# Altium schematic sheet SKC_DataComm.SchDoc: SKC Data Comm
size A4; Author: eldar6776@hotmail.com; DrawnBy: Eldar Dedić; Organization: PROVEN d.o.o.; Address1: Adema Buće 102; Address2: 71000 Sarajevo; Address3: Federacija BiH; Address4: Bosna i Hercegovina; DocumentNumber: DE211213; Revision: 001; SheetNumber: 15; SheetTotal: 15; ProjectName: MIKSER SIROVINE
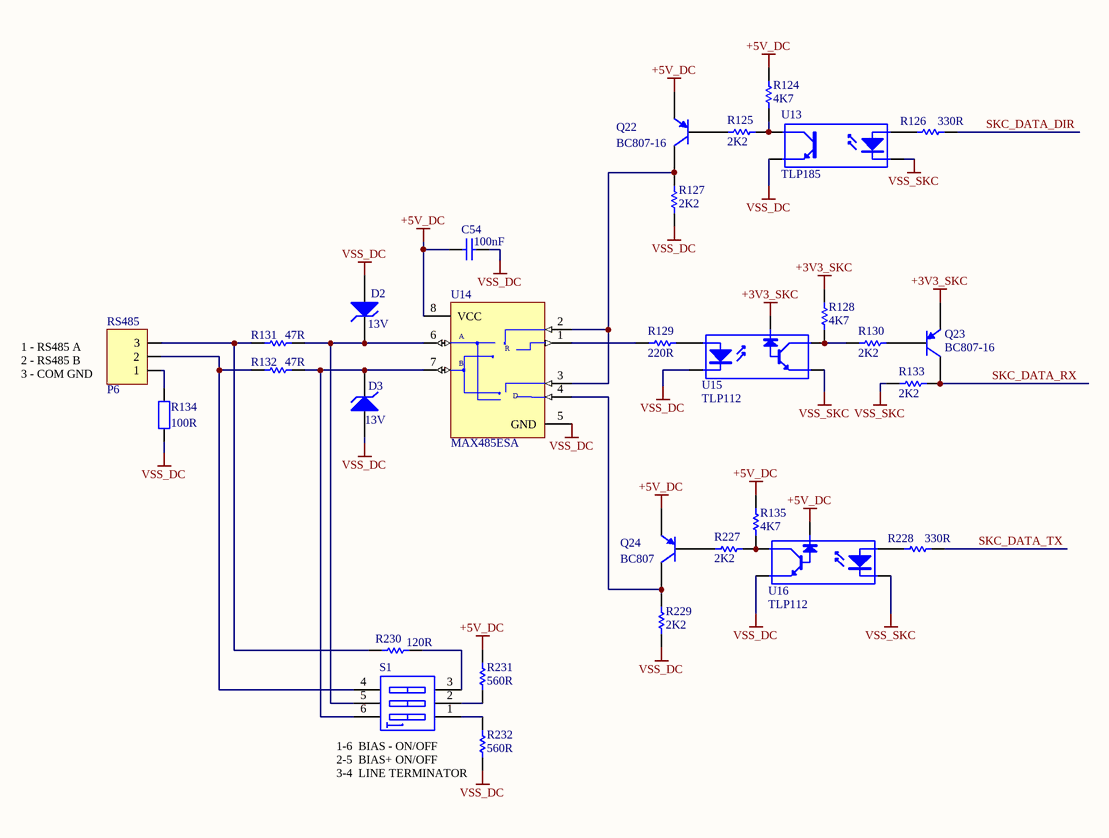
[diagram p0: SKC_DataComm.SchDoc]

## Parts
C54  100nF  [1206]
D2  13V  [DO-35A]
D3  13V  [DO-35A]
P6  RS485  [TERMINAL BLOK 3]
Q22  BC807-16  [SOT23_N]
Q23  BC807-16  [SOT23_N]
Q24  BC807  [SOT23_N]
R124  4K7  [ERA-0805]
R125  2K2  [ERA-0805]
R126  330R  [ERA-0805]
R127  2K2  [8-1206]
R128  4K7  [ERA-0805]
R129  220R  [ERA-0805]
R130  2K2  [ERA-0805]
R131  47R  [ERA-0805]
R132  47R  [ERA-0805]
R133  2K2  [8-1206]
R134  100R  [AXIAL-0.4]
R135  4K7  [ERA-0805]
R227  2K2  [8-1206]
R228  330R  [ERA-0805]
R229  2K2  [8-1206]
R230  120R  [ERA-0805]
R231  560R  [ERA-0805]
R232  560R  [ERA-0805]
S1  (no value)  [DIP-6]
U13  TLP185  [SOP4]
U14  MAX485ESA  [NSO8_N]
U15  TLP112  [SOP5]
U16  TLP112  [SOP5]

## Nets
+3V3_SKC: Q23.2(E) R128.1 U15.6(K)
+5V_DC: C54.2 Q22.2(E) Q24.2(E) R124.1 R135.1 R231.2 U14.8(VCC) U16.6(K)
VSS_DC: C54.1 D2.1(A) D3.1(A) R127.1 R134.1 R229.1 R232.1 U13.4(E) U14.5(GND) U15.3(K) U16.4(E)
VSS_SKC: R133.1 U13.3(K) U15.4(E) U16.3(K)
SKC_DATA_DIR: R126.2
SKC_DATA_RX: Q23.3(C) R133.2
SKC_DATA_TX: R228.2
NetD2_2: D2.2(K) R131.2 S1.5(B2) U14.6(A)
NetD3_2: D3.2(K) R132.2 S1.6(B1) U14.7(B)
NetP6_1: P6.1 R134.2
NetP6_2: P6.2 R132.1 S1.4(B3)
NetP6_3: P6.3 R131.1 R230.1
NetQ22_1: Q22.1(B) R125.2
NetQ22_3: Q22.3(C) R127.2 U14.2(~{RE}) U14.3(DE)
NetQ23_1: Q23.1(B) R130.1
NetQ24_1: Q24.1(B) R227.2
NetQ24_3: Q24.3(C) R229.2 U14.4(DI)
NetR124_2: R124.2 R125.1 U13.6(C)
NetR126_1: R126.1 U13.1(A)
NetR128_2: R128.2 R130.2 U15.5(C)
NetR129_1: R129.1 U15.1(A)
NetR129_2: R129.2 U14.1(RO)
NetR135_2: R135.2 R227.1 U16.5(C)
NetR228_1: R228.1 U16.1(A)
NetR230_2: R230.2 S1.3(A3)
NetR231_1: R231.1 S1.2(A2)
NetR232_2: R232.2 S1.1(A1)

## Notes on the sheet
- 1 - RS485 A
  2 - RS485 B
  3 - COM GND
- (near R232) 1-6  BIAS - ON/OFF
  2-5  BIAS+ ON/OFF
  3-4  LINE TERMINATOR
- Title
- Size:
- Date:
- A4
- Number:
- Time:
- Revision:
- Sheet
- of
- File:
- (in symbol MAX485ESA) R; D

## Library data of the parts
C54 = C1206: Ceramic Chip Capacitor - Standard; Published: 17-Jul-2002; LatestRevisionDate: 19-Mar-2004; LatestRevisionNote: Silkscreen size reduced.; DatasheetDocument: Mar-2001; PackageDocument: Mar-2001; PackageReference: 1206; Publisher: Altium Limited; Code_JEITA: 1206; Code_IPC: 3216 [1206]; ComponentLink1Description: Manufacturer Link; ComponentLink1URL: http://www.kemet.com/; ComponentLink2Description: Datasheet; ComponentLink2URL: http://www.kemet.com/kemet/web/homepage/kechome.nsf/vapubfilesname/F3102TA.pdf/$file/F3102TA.pdf
D2 D3 = D Zener: Zener Diode; Published: 8-Jun-2000; LatestRevisionDate: 17-Jul-2002; LatestRevisionNote: Re-released for DXP Platform.; PackageReference: DIODE-0.7; Publisher: Altium Limited; PackageDescription: Diode, Thru-Hole; 2 Leads; 0.7 in Pin Spacing
P6 = TERMINAL BLOK 3: 3 pinski terminal blok konektor
Q22-Q24 = BC807-16: PNP General-purpose Transistor; Published: 17-Sep-2003; LatestRevisionDate: 12-Dec-2006; LatestRevisionNote: IPC-7351 Footprint Added.; DatasheetVersion: 8-Apr-1999; PackageVersion: May-1999; PackageReference: SOT23; Publisher: Altium Limited; PackageDescription: 3-Pin SOT-23 Package 0.95 mm Pitch, 2.3 mm Lead Span; ComponentLink1Description: Manufacturer Link; ComponentLink1URL: http://www.semiconductors.philips.com/; ComponentLink2Description: Datasheet; ComponentLink2URL: http://www.semiconductors.philips.com/acrobat/datasheets/BC807_BC807W_BC327_5.pdf
R124 R125 R128-R132 R135 R230-R232 = ERAS: Metal Film Thermosensitive Chip Resistor, 0.56 Ohm to 10k Ohm Range, 5% Tolerance, 0805 Size, 0.1 W; Note: If flow soldering, adjust pad width of PCB Footprint to 0.7 - 0.8 times the width of the resistor.; Published: 17-Dec-2003; LatestRevisionDate: 19-Mar-2004; LatestRevisionNote: Silkscreen size reduced.; PackageDocument: Mar-2003; PackageReference: ERA-0805; Publisher: Altium Limited; Code_IPC: 2012 [0805]; ComponentLink1Description: Manufacturer Link; ComponentLink1URL: http://www.panasonic.com/industrial/components/resistive_products.htm; ComponentLink2Description: Datasheet; ComponentLink2URL: http://www.panasonic.com/industrial/components/pdf/AOF0000CE1.pdf
R126 R228 = ERA6Y: Rectangular Thick Film Chip Resistor, 10 Ohm to 1M Ohm Range, 0.1% and 0.5% Tolerance, 0805 Size, 0.1 W; Note: If flow soldering, adjust pad width of PCB Footprint to 0.7 - 0.8 times the width of the resistor.; Published: 17-Dec-2003; LatestRevisionDate: 19-Mar-2004; LatestRevisionNote: Silkscreen size reduced.; PackageDocument: Mar-2003; PackageReference: ERA-0805; Publisher: Altium Limited; Code_IPC: 2012 [0805]; ComponentLink1Description: Manufacturer Link; ComponentLink1URL: http://www.panasonic.com/industrial/components/resistive_products.htm; ComponentLink2Description: Datasheet; ComponentLink2URL: http://www.panasonic.com/industrial/components/pdf/AOA0000CE8.pdf
R127 R133 R227 R229 = ERJ8GE: Thick Film Chip Resistor, 1 Ohm to 10M Ohm Range, 5% Tolerance, 1206 Size, 0.25 W; Note: If flow soldering, adjust pad width of PCB Footprint to 0.7 - 0.8 times the width of the resistor.; Published: 17-Dec-2003; LatestRevisionDate: 19-Mar-2004; LatestRevisionNote: Silkscreen size reduced.; PackageDocument: Mar-2003; PackageReference: 8-1206; Publisher: Altium Limited; Code_IPC: 3216 [1206]; ComponentLink1Description: Manufacturer Link; ComponentLink1URL: http://www.panasonic.com/industrial/components/resistive_products.htm; ComponentLink2Description: Datasheet; ComponentLink2URL: http://www.panasonic.com/industrial/components/pdf/AOA0000CE1.pdf
R134 = Res2: Resistor; Published: 8-Jun-2000; LatestRevisionDate: 17-Jul-2002; LatestRevisionNote: Re-released for DXP Platform.; PackageReference: AXIAL-0.4; Publisher: Altium Limited; PackageDescription: Axial Device, Thru-Hole; 2 Leads; 0.4 in Pin Spacing
S1 = SW DIP-3: DIP Switch, 3 Position, SPST; Published: 24-Mar-1999; LatestRevisionDate: 17-Jul-2002; LatestRevisionNote: Re-released for DXP Platform.; PackageReference: DIP-6; Publisher: Altium Limited; Code_JEDEC: MO-001-AM
U13 = TLP185: 4 Pin Mini Flat Pack Optocoupler; Published: 24-Mar-1999; LatestRevisionDate: 04-Mar-2005; LatestRevisionNote: PCB Footprint replaced, Sch pins re-numbered.; DatasheetVersion: Apr-2004; PackageReference: SOP5(6); Publisher: Altium Limited; PackageDescription: Small Outline; 6 Leads (1 Absent); Body Width 4.4 mm; Pitch 1.27 mm
U14 = MAX485ESA: Low-Power, Slew-Rate-Limited RS-485/RS-422 Transceiver; Published: 16-Jan-2001; LatestRevisionDate: 13-Apr-2006; LatestRevisionNote: IPC-7351 Footprint Added.; DatasheetVersion: Feb-1996; PackageReference: NSO8; Publisher: Altium Limited; PackageDescription: 8-Pin Small Outline Integrated Circuit 1.27 mm Pitch; Code_JEDEC: MS-012-AA; Code_IPC: SOIC127P600-8; ComponentLink1Description: Manufacturer Link; ComponentLink1URL: http://www.maxim-ic.com/; ComponentLink2Description: Datasheet; ComponentLink2URL: http://pdfserv.maxim-ic.com/en/ds/MAX1487-MAX491.pdf
U15 U16 = TLP112: 5 Pin Mini Flat Pack Optocoupler; Published: 24-Mar-1999; LatestRevisionDate: 04-Mar-2005; LatestRevisionNote: PCB Footprint replaced, Sch pins re-numbered.; DatasheetVersion: Apr-2004; PackageReference: SOP5(6); Publisher: Altium Limited; PackageDescription: Small Outline; 6 Leads (1 Absent); Body Width 4.4 mm; Pitch 1.27 mm